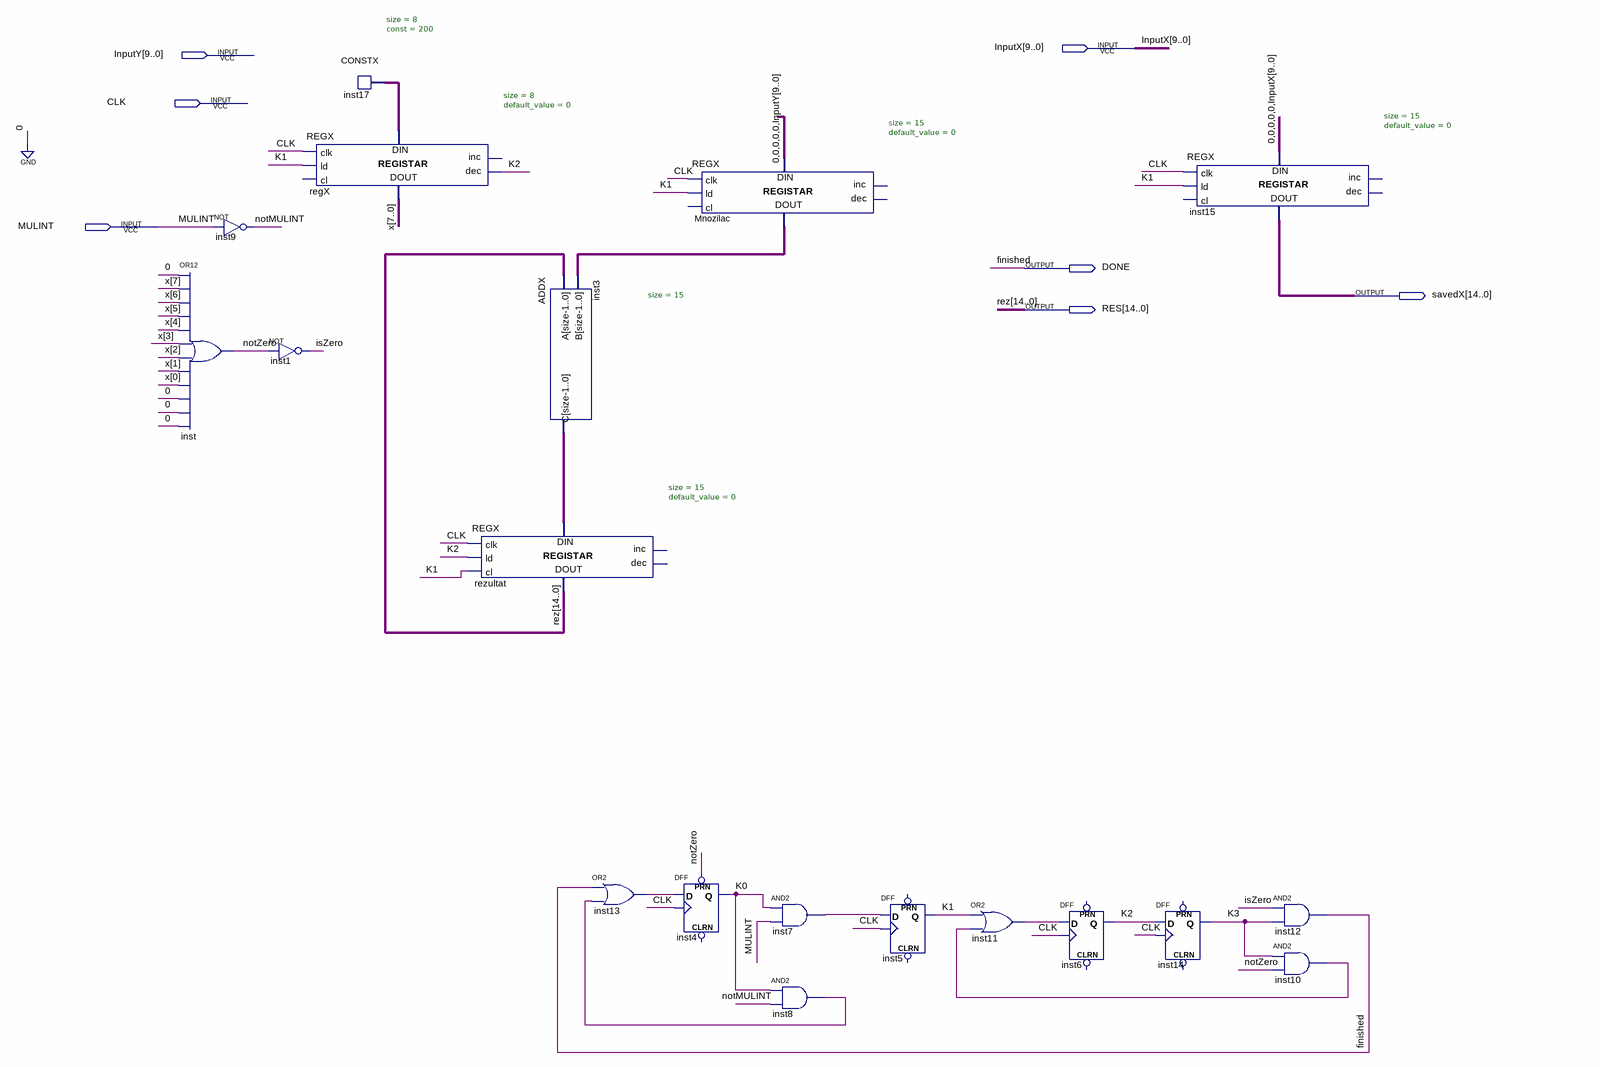
[diagram p0: schematic sheet]
// Quartus schematic MULINT.bdf as structural Verilog: 19 symbols, 7 pins
module MULINT (
  input  [9:0] InputX,
  input  [9:0] InputY,
  input  CLK,
  input  MULINT,
  output DONE,
  output [14:0] savedX,
  output [14:0] RES
);

  wire inst7_out, inst8_out, inst10_out, inst11_out, inst13_out, isZero, K0, K1, K2, K3, notMULINT, notZero;
  wire [7:0] inst17_data, x;
  wire [14:0] inst3_c, Mnozilac_data_out;

  or inst (notZero, 1'b0, x[7], x[6], x[5], x[4], x[3], x[2], x[1], x[0], 1'b0, 1'b0, 1'b0);
  not inst9 (notMULINT, MULINT);
  REGX #(.size(8), .default_value(0)) regX (
    .clk(CLK), .ld(K1), .dec(K2), .data_in(inst17_data), .data_out(x));  // open: cl, inc
  not inst1 (isZero, notZero);
  CONSTX #(.size(8), .\const (200)) inst17 (.data(inst17_data));
  REGX #(.size(15), .default_value(0)) rezultat (
    .clk(CLK), .ld(K2), .cl(K1), .data_in(inst3_c), .data_out(RES));  // open: inc, dec
  ADDX #(.size(15)) inst3 (.A(RES), .B(Mnozilac_data_out), .C(inst3_c));
  or inst13 (inst13_out, DONE, inst8_out);
  REGX #(.size(15), .default_value(0)) Mnozilac (
    .clk(CLK), .ld(K1), .data_in({{5{1'b0}}, InputY}), .data_out(Mnozilac_data_out));  // open: cl, inc, dec
  DFF inst4 (.CLK(CLK), .D(inst13_out), .PRN(notZero), .Q(K0));  // open: CLRN
  and inst7 (inst7_out, K0, MULINT);
  and inst8 (inst8_out, K0, notMULINT);
  DFF inst5 (.CLK(CLK), .D(inst7_out), .Q(K1));  // open: CLRN, PRN
  or inst11 (inst11_out, K1, inst10_out);
  DFF inst6 (.CLK(CLK), .D(inst11_out), .Q(K2));  // open: CLRN, PRN
  REGX #(.size(15), .default_value(0)) inst15 (
    .clk(CLK), .ld(K1), .data_in({{5{1'b0}}, InputX}), .data_out(savedX));  // open: cl, inc, dec
  DFF inst14 (.CLK(CLK), .D(K2), .Q(K3));  // open: CLRN, PRN
  and inst12 (DONE, isZero, K3);
  and inst10 (inst10_out, K3, notZero);

  // Other names for the same wires on the sheet: finished = DONE; rez[14:0] = RES
endmodule
